# EAGLE design balance (EAGLE 6.6.0)
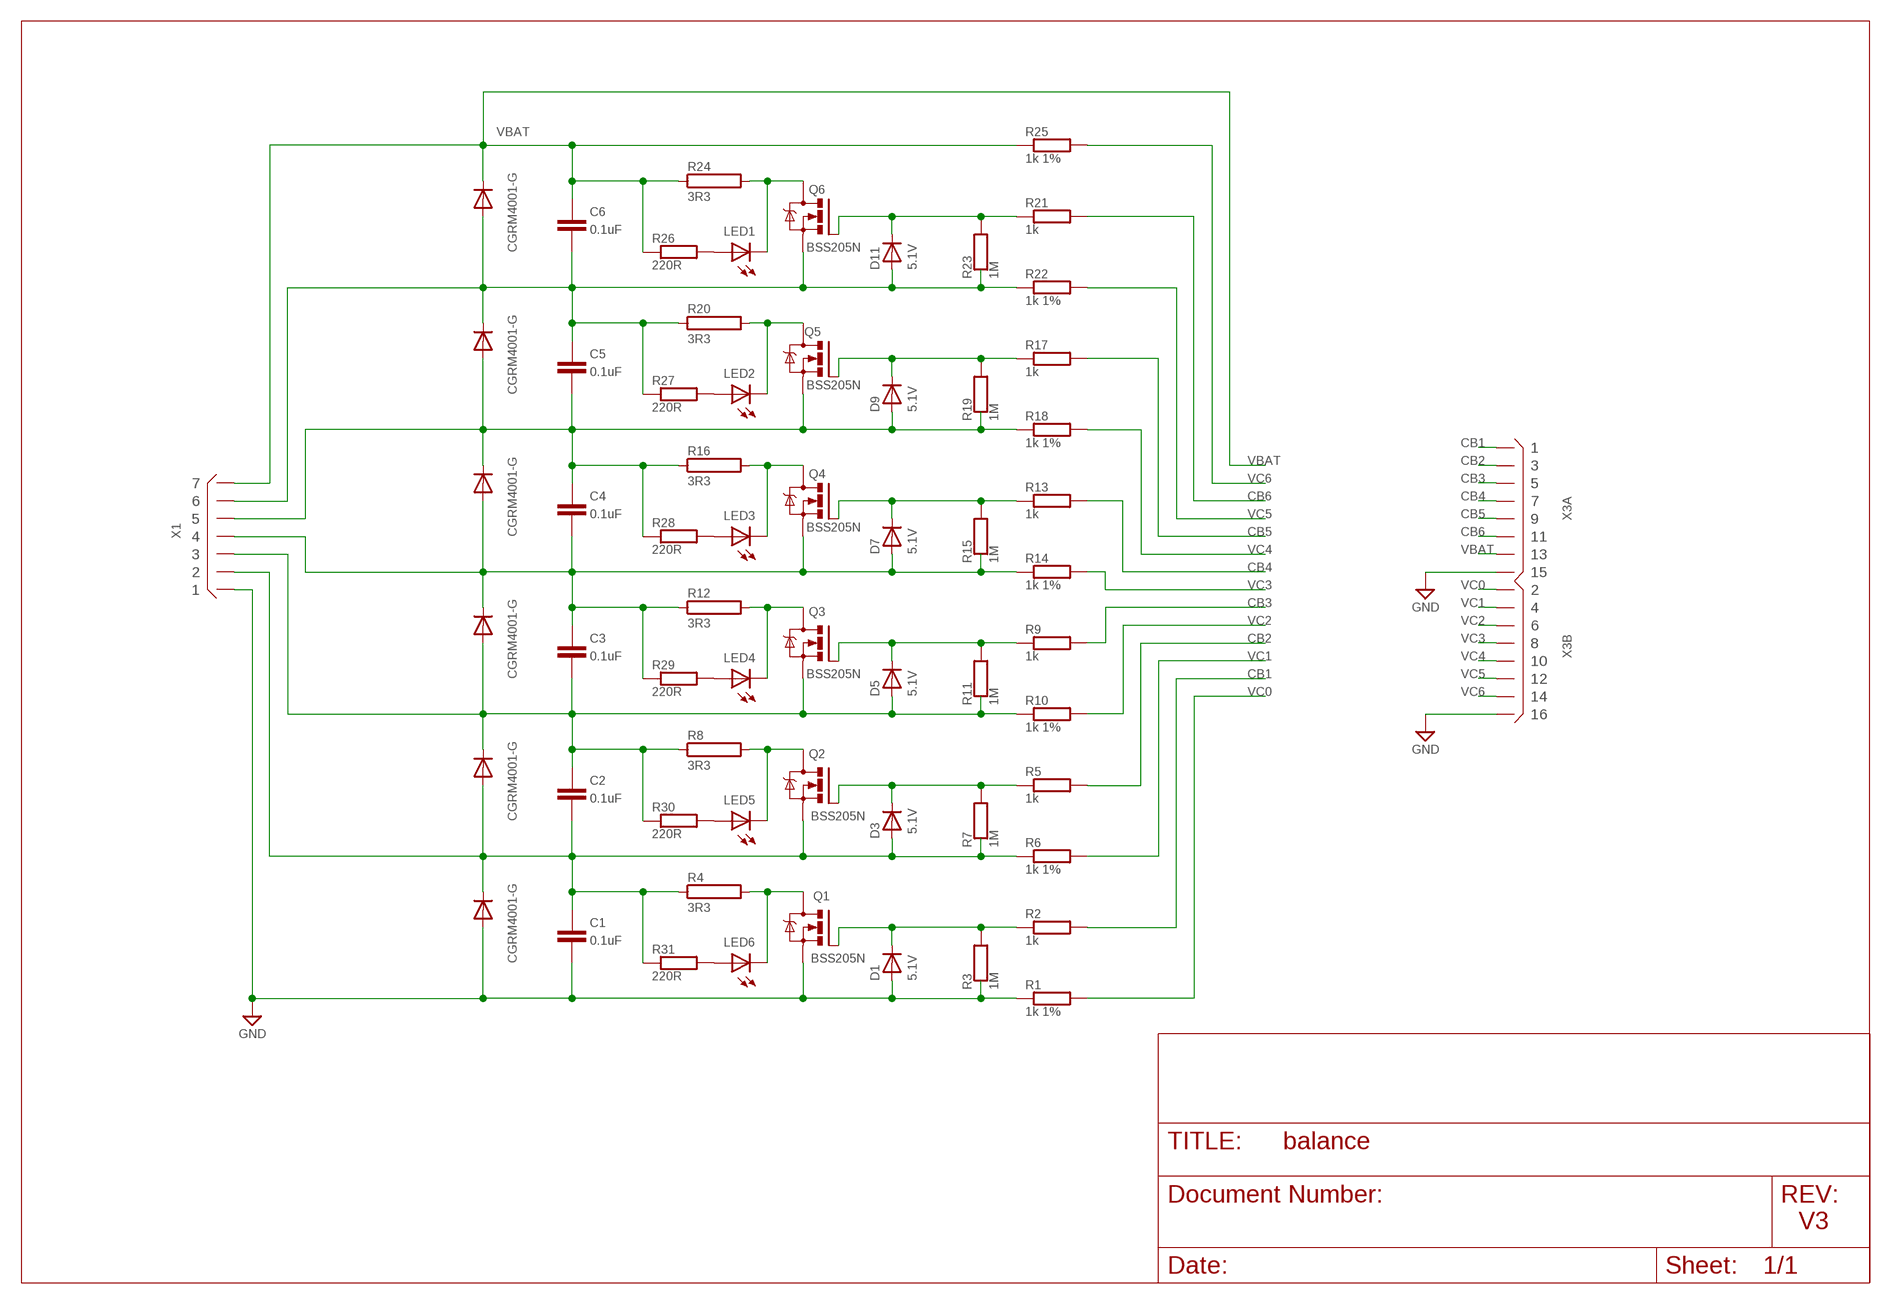
[diagram p0: schematic, sheet 1]

## Parts
C1  0.1uF  CSTD  [C0805]
C2  0.1uF  CSTD  [C0805]
C3  0.1uF  CSTD  [C0805]
C4  0.1uF  CSTD  [C0805]
C5  0.1uF  CSTD  [C0805]
C6  0.1uF  CSTD  [C0805]
D1  5.1V  DIODESOD  [SOD-323]
D2  CGRM4001-G  [SOD-123_MINI-SMA]
D3  5.1V  DIODESOD  [SOD-323]
D4  CGRM4001-G  [SOD-123_MINI-SMA]
D5  5.1V  DIODESOD  [SOD-323]
D6  CGRM4001-G  [SOD-123_MINI-SMA]
D7  5.1V  DIODESOD  [SOD-323]
D8  CGRM4001-G  [SOD-123_MINI-SMA]
D9  5.1V  DIODESOD  [SOD-323]
D10  CGRM4001-G  [SOD-123_MINI-SMA]
D11  5.1V  DIODESOD  [SOD-323]
D12  CGRM4001-G  [SOD-123_MINI-SMA]
LED1  LEDCHIP-LED0805  [CHIP-LED0805]
LED2  LEDCHIP-LED0805  [CHIP-LED0805]
LED3  LEDCHIP-LED0805  [CHIP-LED0805]
LED4  LEDCHIP-LED0805  [CHIP-LED0805]
LED5  LEDCHIP-LED0805  [CHIP-LED0805]
LED6  LEDCHIP-LED0805  [CHIP-LED0805]
Q1  BSS205N  [SOT23]
Q2  BSS205N  [SOT23]
Q3  BSS205N  [SOT23]
Q4  BSS205N  [SOT23]
Q5  BSS205N  [SOT23]
Q6  BSS205N  [SOT23]
R1  1k 1%  R  [R0805]
R2  1k  R  [R0805]
R3  1M  R  [R0805]
R4  3R3  R  [HS15]
R5  1k  R  [R0805]
R6  1k 1%  R  [R0805]
R7  1M  R  [R0805]
R8  3R3  R  [HS15]
R9  1k  R  [R0805]
R10  1k 1%  R  [R0805]
R11  1M  R  [R0805]
R12  3R3  R  [HS15]
R13  1k  R  [R0805]
R14  1k 1%  R  [R0805]
R15  1M  R  [R0805]
R16  3R3  R  [HS15]
R17  1k  R  [R0805]
R18  1k 1%  R  [R0805]
R19  1M  R  [R0805]
R20  3R3  R  [HS15]
R21  1k  R  [R0805]
R22  1k 1%  R  [R0805]
R23  1M  R  [R0805]
R24  3R3  R  [HS15]
R25  1k 1%  R  [R0805]
R26  220R  R  [R0805]
R27  220R  R  [R0805]
R28  220R  R  [R0805]
R29  220R  R  [R0805]
R30  220R  R  [R0805]
R31  220R  R  [R0805]
X1  B7B-XH  [B7B-XH]
X3  X08X2DR  [X16R-DIL]

## Nets
1: LED6.C Q1.3(D) R4.2
2: C1.2 C2.1 D2.C D3.2(A) D4.A Q2.2(S) R4.1 R6.1 R7.1 R31.1 X1.P$2
3: LED5.C Q2.3(D) R8.2
4: C2.2 C3.1 D4.C D5.2(A) D6.A Q3.2(S) R8.1 R10.1 R11.1 R30.1 X1.P$3
5: LED4.C Q3.3(D) R12.2
6: C3.2 C4.1 D6.C D7.2(A) D8.A Q4.2(S) R12.1 R14.1 R15.1 R29.1 X1.P$4
7: LED3.C Q4.3(D) R16.2
8: C4.2 C5.1 D8.C D9.2(A) D10.A Q5.2(S) R16.1 R18.1 R19.1 R28.1 X1.P$5
9: LED2.C Q5.3(D) R20.2
10: C5.2 C6.1 D10.C D11.2(A) D12.A Q6.2(S) R20.1 R22.1 R23.1 R27.1 X1.P$6
11: LED1.C Q6.3(D) R24.2
CB1: R2.2 X3.1
CB2: R5.2 X3.3
CB3: R9.2 X3.5
CB4: R13.2 X3.7
CB5: R17.2 X3.9
CB6: R21.2 X3.11
GND: C1.1 D1.2(A) D2.A Q1.2(S) R1.1 R3.1 X1.P$1 X3.15 X3.16
N$2: D1.1(C) Q1.1(G) R2.1 R3.2
N$4: D3.1(C) Q2.1(G) R5.1 R7.2
N$5: LED1.A R26.2
N$6: LED2.A R27.2
N$7: LED3.A R28.2
N$8: D5.1(C) Q3.1(G) R9.1 R11.2
N$9: LED4.A R29.2
N$10: LED5.A R30.2
N$11: LED6.A R31.2
N$12: D7.1(C) Q4.1(G) R13.1 R15.2
N$17: D9.1(C) Q5.1(G) R17.1 R19.2
N$21: D11.1(C) Q6.1(G) R21.1 R23.2
VBAT: C6.2 D12.C R24.1 R25.1 R26.1 X1.P$7 X3.13
VC0: R1.2 X3.2
VC1: R6.2 X3.4
VC2: R10.2 X3.6
VC3: R14.2 X3.8
VC4: R18.2 X3.10
VC5: R22.2 X3.12
VC6: R25.2 X3.14

## Notes on the sheet
- V3

## Library data of the parts
C1-C6 = useful:C
D1 D3 D5 D7 D9 D11 = SparkFun:DIODE: Diode These are standard reverse protection diodes and small signal diodes. SMA package can handle up to about 1A. SOD-323 can handle about 200mA. What the SOD-323 package when ordering, there are some mfgs out there that are 5-pin packages.
D2 D4 D6 D8 D10 D12 = diode:CGRM400*-G: Molded plasitc,JEDEC SOD-123/Mini SMA Source: Comchip CGRM4001-G.pdf
LED1-LED6 = led:LED: LED OSRAM: - CHIPLED LG R971, LG N971, LY N971, LG Q971, LY Q971, LO R971, LY R971 LH N974, LH R974 LS Q976, LO Q976, LY Q976 LO Q996 - Hyper CHIPLED LW Q18S LB Q993, LB Q99A, LB R99A - SideLED LS A670, LO A670, LY A670, LG A670, LP A670 LB A673, LV A673, LT A673, LW A673 LH A674 LY A675 LS A676, LA A676, LO A676, LY A676, LW A676 LS A679, LY A679, LG A679 - Hyper Micro SIDELED® LS Y876, LA Y876, LO Y876, LY Y876 LT Y87S - SmartLED LW L88C, LW L88S LB L89C, LB L89S, LG L890 LS L89K, LO L89K, LY L89K LS L896, LA L896, LO L896, LY L896 - TOPLED LS T670, LO T670, LY T670, LG T670, LP T670 LSG T670, LSP T670, LSY T670, LOP T670, LYG T670 LG T671, LOG T671, LSG T671 LB T673, LV T673, LT T673, LW T673 LH T674 LS T676, LA T676, LO T676, LY T676, LB T676, LH T676, LSB T676, LW T676 LB T67C, LV T67C, LT T67C, LS T67K, LO T67K, LY T67K, LW E67C LS E67B, LA E67B, LO E67B, LY E67B, LB E67C, LV E67C, LT E67C LW T67C LS T679, LY T679, LG T679 LS T770, LO T770, LY T770, LG T770, LP T770 LB T773, LV T773, LT T773, LW T773 LH T774 LS E675, LA E675, LY E675, LS T675 LS T776, LA T776, LO T776, LY T776, LB T776 LHGB T686 LT T68C, LB T68C - Hyper Mini TOPLED® LB M676 - Mini TOPLED Santana® LG M470 LS M47K, LO M47K, LY M47K Source: http://www.osram.convergy.de LUXEON: - LUMILED® LXK2-PW12-R00, LXK2-PW12-S00, LXK2-PW14-U00, LXK2-PW14-V00 LXK2-PM12-R00, LXK2-PM12-S00, LXK2-PM14-U00 LXK2-PE12-Q00, LXK2-PE12-R00, LXK2-PE12-S00, LXK2-PE14-T00, LXK2-PE14-U00 LXK2-PB12-K00, LXK2-PB12-L00, LXK2-PB12-M00, LXK2-PB14-N00, LXK2-PB14-P00, LXK2-PB14-Q00 LXK2-PR12-L00, LXK2-PR12-M00, LXK2-PR14-Q00, LXK2-PR14-R00 LXK2-PD12-Q00, LXK2-PD12-R00, LXK2-PD12-S00 LXK2-PH12-R00, LXK2-PH12-S00 LXK2-PL12-P00, LXK2-PL12-Q00, LXK2-PL12-R00 Source: www.luxeon.com KINGBRIGHT: KA-3528ASYC Source: www.kingbright.com
Q1-Q6 = infineon:BSS205N: Infineon Small Signal Transistor, OptiMOS 2 Technology, 20V, 2.5A SOT23
R1-R3 R5-R7 R9-R11 R13-R15 R17-R19 R21-R23 R25-R31 = useful:R
R4 R8 R12 R16 R20 R24 = special:R
X1 = con-jst-xh:?7B-XH
X3 = connectors:X08X2: Connector 2x8 pins

## Board
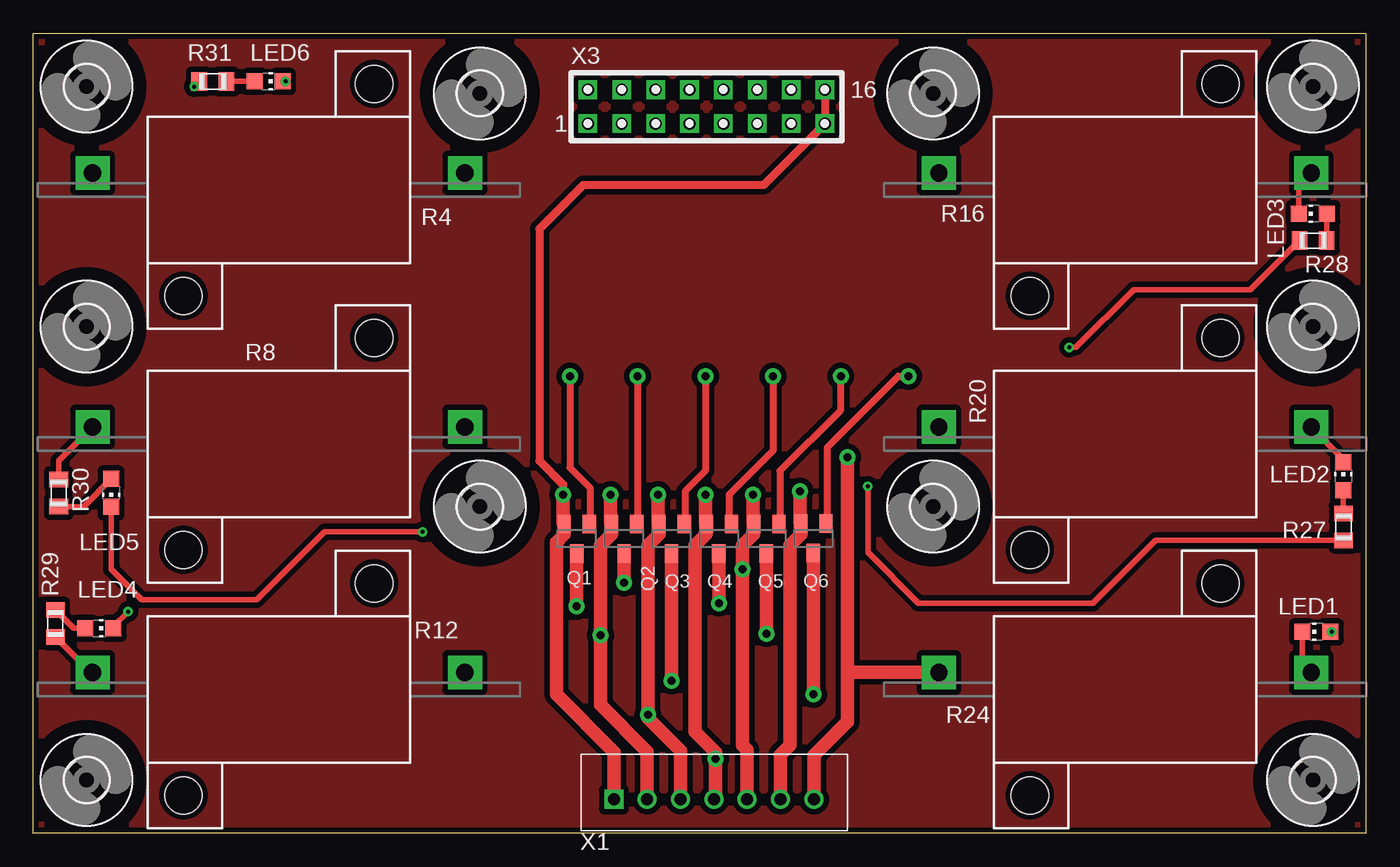
[diagram p1: board, top side]
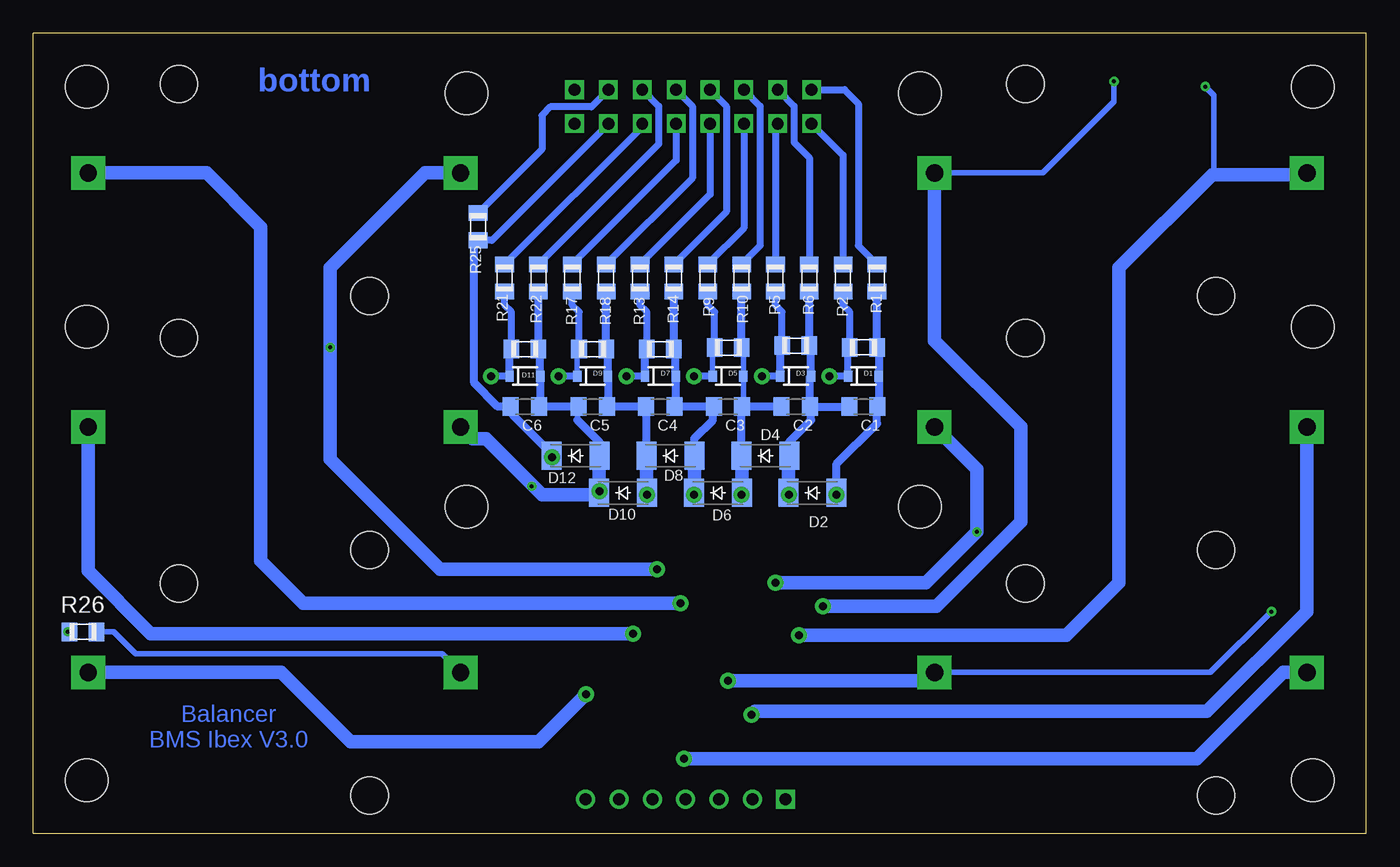
[diagram p2: board, bottom side, seen from below]

Size 100 x 60 mm. Coordinates in mm from the lower left corner, seen from the top.
Outline: 0,0 0,60 100,60 100,0 0,0
Copper layers (1+2*15+16): Top 0.035mm / dielectric 0.2mm / Route2 0.035mm / dielectric 0.5mm / Route15 0.035mm / dielectric 0.2mm / Bottom 0.035mm
Design rules "ats_35u_4layer_2 *": minimum track width 10mil, minimum drill 0.2mm, track to track 10mil, track to pad 10mil, pad to pad 10mil, via to via 10mil, smd to smd 10mil, copper to edge 0.3mm, drill to drill 8mil, minimum pad ring 10mil, minimum via ring 0.2mm, stop-mask expansion 4mil, vias tented up to drill 0mil, thermal gap 10mil

### Footprints (pad centres in the part's own frame; a part is rotated, then mirrored left to right if it is on the bottom)
C0805 = smd 1.2 x 1.4: 1 -1.066,0; 2 1.066,0
SOD-323 = smd 0.63 x 0.83: 1 -1.15,0; 2 1.15,0
SOD-123_MINI-SMA = smd 1.5 x 2.1: A 1.8,0; C -1.8,0
CHIP-LED0805 = smd 1.2 x 1.2: A 0,-1.05; C 0,1.05
SOT23 = smd 1 x 1.4: 1 -0.95,-1.1; 2 0.95,-1.1; 3 0,1.1
R0805 = smd 1.168 x 1.397: 1 -1.016,0; 2 1.016,0
HS15 = drill 1.3 pad 2.54 square: 1 -13.97,1.27; 2 13.97,1.27 | hole 2.8: -7.15,-7.95; 7.15,7.95
3,2 = hole 3.2: 0,0
B7B-XH = drill 0.9 pad 1.422 square: P$1 0,0 | drill 0.9 pad 1.422: P$2 2.5,0; P$3 5,0; P$4 7.5,0; P$5 10,0; P$6 12.5,0; P$7 15,0
X16R-DIL = drill 0.889 pad 1.397 square: 1 -8.89,-1.27; 2 -8.89,1.27; 3 -6.35,-1.27; 4 -6.35,1.27; 5 -3.81,-1.27; 6 -3.81,1.27; 7 -1.27,-1.27; 8 -1.27,1.27; 9 1.27,-1.27; 10 1.27,1.27; 11 3.81,-1.27; 12 3.81,1.27; 13 6.35,-1.27; 14 6.35,1.27; 15 8.89,-1.27; 16 8.89,1.27

### Placement (x,y rotation side)
C1  37.72,32 180 bottom
C2  42.8,32 180 bottom
C3  47.88,32 180 bottom
C4  52.96,32 180 bottom
C5  58.04,32 180 bottom
C6  63.12,32 180 bottom
D1  37.72,34.29 0 bottom
D2  41.53,25.53 0 bottom
D3  42.8,34.29 0 bottom
D4  45.09,28.32 0 bottom
D5  47.88,34.29 0 bottom
D6  48.64,25.53 0 bottom
D7  52.96,34.29 0 bottom
D8  52.2,28.32 0 bottom
D9  58.04,34.29 0 bottom
D10  55.75,25.53 0 bottom
D11  63.12,34.29 0 bottom
D12  59.31,28.32 0 bottom
LED1  96.27,15.11 90 top
LED2  98.3,26.8 0 top
LED3  96.01,46.48 90 top
LED4  4.95,15.37 270 top
LED5  5.84,25.53 180 top
LED6  17.65,56.39 270 top
Q1  40.77,22.1 180 top
Q2  44.32,22.1 180 top
Q3  47.88,22.1 180 top
Q4  51.44,22.1 180 top
Q5  54.99,22.1 180 top
Q6  58.52,22.13 180 top
R1  36.7,41.66 90 bottom
R2  39.24,41.66 90 bottom
R3  37.72,36.45 180 bottom
R4  18.41,48.26 0 top
R5  44.32,41.66 90 bottom
R6  41.78,41.66 90 bottom
R7  42.8,36.58 180 bottom
R8  18.41,29.21 0 top
R9  49.4,41.66 90 bottom
R10  46.86,41.66 90 bottom
R11  47.87,36.44 180 bottom
R12  18.41,10.79 0 top
R13  54.48,41.66 90 bottom
R14  51.94,41.66 90 bottom
R15  52.96,36.32 180 bottom
R16  81.92,48.26 0 top
R17  59.56,41.66 90 bottom
R18  57.02,41.66 90 bottom
R19  58.04,36.32 180 bottom
R20  81.92,29.21 0 top
R21  64.64,41.66 90 bottom
R22  62.1,41.66 90 bottom
R23  63.12,36.32 180 bottom
R24  81.92,10.79 0 top
R25  66.64,45.5 90 bottom
R26  96.27,15.11 180 bottom
R27  98.3,22.99 90 top
R28  96.01,44.45 0 top
R29  1.65,15.75 90 top
R30  1.91,25.53 270 top
R31  13.46,56.39 0 top
U$1  [3,2]  4,4 0 top
U$2  [3,2]  4,56 0 top
U$3  [3,2]  96,4 0 top
U$4  [3,2]  96,56 0 top
U$5  [3,2]  67.5,55.5 0 top
U$6  [3,2]  33.5,55.5 0 top
U$7  [3,2]  67.5,24.5 0 top
U$8  [3,2]  4,38 0 top
U$9  [3,2]  96,38 0 top
U$10  [3,2]  33.5,24.5 0 top
X1  43.56,2.54 0 top
X3  50.5,54.5 0 top

### Tracks (layer width: path | path; a pad name or v marks a point on that pad's centre or on a via)
1  (via drill 0.3, 0.6)
  Top 0.406: LED6.C v18.92,56.39
  Top 1.016: Q1.3 v40.77,17.02
  Bottom 0.406: R4.2 24.26,49.53 18.92,54.86 v18.92,56.39
  Bottom 1.016: v40.77,17.02 32.26,17.02 25.91,23.37 25.91,30.48 32.38,36.96 R4.2
2  (via drill 0.3, 0.6)
  Top 0.406: R31.1 v12.06,56.01
  Top 1.016: v43.31,25.4 43.31,23.26 Q2.2 43.37,22.42 42.55,21.59 v42.55,14.86 42.55,9.65 46.06,6.14 X1.P$2
  Bottom 0.406: 41.65,36.44 R7.1 | 43.24,25.44 D2.C | 43.33,28.28 D4.A | 41.66,31.93 C2.1 | 41.73,34.21 D3.2 | v12.06,56.01 11.43,55.37 11.43,49.4
  Bottom 0.508: 43.24,25.44 43.27,25.44 v43.31,25.4
  Bottom 0.61: R7.1 R6.1 | D3.2 41.65,36.44 | C1.2 C2.1 41.73,34.21 | D4.A 43.28,29.36 41.66,30.99 41.66,31.93
  Bottom 1.016: D2.C 43.33,28.28 | v42.55,14.86 22.48,14.86 18.54,18.8 18.54,42.42 11.56,49.4 11.43,49.4 4.57,49.4 R4.1
3  (via drill 0.3, 0.6)
  Top 0.406: LED5.C 5.84,19.81 8.13,17.53 16.76,17.53 21.84,22.61 v29.21,22.61
  Top 1.016: Q2.3 v44.32,18.8
  Bottom 1.016: v44.32,18.8 33.91,18.8 33.4,18.8 33.02,18.8 v29.21,22.61 29.21,27.3 R8.2
4  (via drill 0.6)
  Top 0.406: R30.1 1.91,27.94 R8.1
  Top 1.016: v46.86,25.4 46.86,23.26 Q3.2 46.93,22.42 46.1,21.59 v46.1,8.89 46.1,8.64 48.56,6.18 X1.P$3
  Bottom 0.406: R11.1 46.73,36.31 D5.2 46.73,32.09 C3.1 46.88,31.93 | 46.84,28.28 D4.C
  Bottom 0.508: D6.A 46.84,25.42 v46.86,25.4 | 46.86,40.89 46.86,40.88 R10.1
  Bottom 0.61: R11.1 46.86,40.89 | C2.2 C3.1 | D4.C 46.88,31.93
  Bottom 1.016: D6.A 46.84,28.28 | v46.1,8.89 45.85,9.14 11.94,9.14 4.45,16.64 R8.1
5  (via drill 0.3, 0.6)
  Top 0.406: LED4.C 6,15.53 v7.11,16.64
  Top 1.016: Q3.3 v47.88,11.43
  Bottom 0.406: R12.2 11.68,12.06 v7.11,16.64
  Bottom 1.016: v47.88,11.43 33.02,11.43 R12.2
6  (via drill 0.6)
  Top 0.406: R29.1 4.32,12.06 R12.1
  Top 1.016: v50.42,25.4 50.42,23.26 Q4.2 50.48,22.42 49.66,21.59 49.66,7.62 51.18,6.1 v51.18,5.59 51.18,2.66 X1.P$4
  Bottom 0.406: 51.81,36.19 R15.1 | 51.81,32.09 C4.1 | 50.4,25.57 D6.C | 49.02,31.93 C3.2
  Bottom 0.508: D6.C 50.44,25.42 v50.42,25.4
  Bottom 0.61: R15.1 R14.1 | 51.81,36.19 D7.2 51.81,32.09 | C3.2 C4.1 | D8.A 50.4,29.61 49.02,30.99 49.02,31.93
  Bottom 1.016: D8.A 50.4,25.57 | v51.18,5.59 12.7,5.59 6.22,12.06 R12.1
7  (via drill 0.6)
  Top 0.406: LED3.C 94.96,48.61 R16.2
  Top 1.016: Q4.3 v51.44,17.27
  Bottom 1.016: v51.44,17.27 79.76,17.27 82.93,20.45 82.93,45.47 87,49.53 R16.2
8  (via drill 0.3, 0.6)
  Top 0.406: R28.1 91.31,40.77 82.55,40.77 78.23,36.45 v77.72,36.45
  Top 1.016: v53.98,25.4 53.98,23.26 Q5.2 54.04,22.42 53.21,21.59 v53.21,19.81 53.21,6.6 53.56,6.26 X1.P$5
  Bottom 0.406: 56.89,36.19 R19.1 | 56.89,32.09 C5.1 | 54,31.98 C4.2
  Bottom 0.508: v53.98,25.4 53.95,25.42 D10.A 54,25.57 54,25.82
  Bottom 0.61: R19.1 R18.1 | 56.89,36.19 D9.2 56.89,32.09 | C4.2 C5.1 | D8.C 54,31.98
  Bottom 1.016: D8.C 54,25.82 | R16.1 70.61,49.53 77.72,42.42 v77.72,36.45 77.72,28.07 69.47,19.81 v53.21,19.81
9  (via drill 0.6)
  Top 0.406: LED2.C 98.3,28.07 R20.2
  Top 1.016: Q5.3 v54.99,14.99
  Bottom 1.016: v54.99,14.99 91.19,14.99 95.89,19.68 R20.2
10  (via drill 0.3, 0.6)
  Top 0.406: Q6.2 57.53,23.23 57.53,23.39 | R27.1 84.2,21.97 79.5,17.27 66.42,17.27 62.61,21.08 v62.61,26.04
  Top 1.016: v57.53,25.65 57.53,23.39 | X1.P$6 56.06,5.9 56.77,6.6 56.77,21.59 57.6,22.42 57.6,23.23 Q6.2
  Bottom 0.406: 61.97,36.19 R23.1 | 61.97,32.09 C6.1 | 57.55,28.28 D12.A | 57.47,25.44 D10.C | 59.18,30.99 59.18,31.93 C5.2 | v62.61,26.04 62.55,26.1
  Bottom 0.508: 57.47,25.44 57.47,25.59 v57.53,25.65
  Bottom 0.61: R23.1 R22.1 | 61.97,36.19 D11.2 61.97,32.09 | C5.2 C6.1 | D12.A 57.51,29.32 59.18,30.99
  Bottom 1.016: 57.55,28.28 D10.C 57.68,25.4 61.85,25.4 62.55,26.1 66.04,29.59 67.06,29.59 R20.1
11  (via drill 0.6)
  Top 0.406: LED1.C 95.22,12.73 R24.2
  Top 1.016: Q6.3 58.52,10.44 v58.55,10.41
  Bottom 1.016: v58.55,10.41 62.1,6.86 76.2,6.86 81.41,12.06 R24.2
CB1
  Bottom 0.508: X3.1 39.24,50.86 R2.2
CB2
  Bottom 0.508: X3.3 44.32,53.06 R5.2
CB3
  Bottom 0.508: X3.5 46.69,45.38 R9.2
CB4
  Bottom 0.508: X3.7 49.23,47.92 R13.2
CB5
  Bottom 0.508: X3.9 51.77,50.47 R17.2
CB6
  Bottom 0.508: 54.31,53.01 R21.2
  Bottom 0.61: X3.11 54.31,53.01
GND  (via drill 0.6)
  Top 0.61: X3.16 X3.15 54.8,48.64 41.27,48.64 37.97,45.34 37.97,27.94 39.75,26.16 39.75,24.89
  Top 1.016: v39.75,25.4 39.75,24.89 39.75,23.26 Q1.2 39.82,22.42 39.24,21.84 39.24,10.41 43.56,6.1 X1.P$1
  Bottom 0.406: 36.57,32.09 C1.1 36.7,31.95 | 39.69,25.48 D2.A
  Bottom 0.508: 39.69,25.48 39.69,25.47 v39.75,25.4 | 36.57,36.44 36.58,36.45 R3.1
  Bottom 0.61: R3.1 R1.1 | 36.57,36.44 D1.2 36.57,32.09 | D2.A 39.73,27.71 36.7,30.73 36.7,31.95
N$1
  pour Top (isolate 0.406): 0,60 100,60 100,0 0,0
N$2  (via drill 0.6)
  Top 0.406: Q1.1 41.78,23.26
  Top 0.508: v40.26,34.29 40.26,27.43 41.78,25.91 41.78,23.26
  Bottom 0.508: R2.1 39.24,39.62 38.73,39.12 R3.2 38.87,36.31 D1.1 v40.26,34.29
N$4  (via drill 0.6)
  Top 0.406: Q2.1 45.27,23.43 45.34,23.5
  Top 0.508: v45.34,34.29 45.34,23.5 45.34,23.26
  Bottom 0.406: 43.95,36.44 R7.2
  Bottom 0.508: R7.2 43.81,39.12 44.32,39.62 R5.1 | D3.1 v45.34,34.29
  Bottom 0.61: D3.1 43.95,36.44
N$5  (via drill 0.3)
  Top 0.406: LED1.A v97.41,15.11
  Bottom 0.406: v97.41,15.11 R26.2
N$6
  Top 0.406: LED2.A R27.2
N$7
  Top 0.406: LED3.A 97.06,44.48 R28.2
N$8  (via drill 0.6)
  Top 0.406: Q3.1 48.83,23.3 48.9,23.37
  Top 0.508: v50.42,34.29 50.42,27.18 48.9,25.65 48.9,23.37 48.9,23.26
  Bottom 0.406: D5.1 49.03,36.3 R11.2
  Bottom 0.508: R11.2 48.89,39.11 49.4,39.62 R9.1 | D5.1 v50.42,34.29
N$9
  Top 0.406: R29.2 3.05,15.37 LED4.A
N$10
  Top 0.406: R30.2 3.78,24.51 LED5.A
N$11
  Top 0.406: R31.2 LED6.A
N$12  (via drill 0.6)
  Top 0.406: Q4.1 52.2,23.39
  Top 0.508: v55.5,34.29 55.5,28.7 52.2,25.4 52.2,23.39
  Bottom 0.406: 54.11,36.19 R15.2
  Bottom 0.508: R15.2 53.98,39.12 54.48,39.62 R13.1 | D7.1 v55.5,34.29
  Bottom 0.61: D7.1 54.11,36.19
N$17  (via drill 0.6)
  Top 0.406: 56.01,23.26 Q5.1
  Top 0.508: 56.01,23.26 56.01,27.18 60.58,31.75 v60.58,34.29
  Bottom 0.406: D9.1 59.19,36.19 R19.2
  Bottom 0.508: R19.2 59.05,39.12 59.56,39.62 R17.1 | D9.1 v60.58,34.29
N$21  (via drill 0.6)
  Top 0.406: Q6.1 59.53,23.23 59.56,23.26
  Top 0.508: 59.56,23.26 59.56,28.96 64.9,34.29 v65.66,34.29
  Bottom 0.406: 64.27,36.19 R23.2
  Bottom 0.508: R23.2 64.14,39.12 64.64,39.62 R21.1 | D11.1 v65.66,34.29
  Bottom 0.61: D11.1 64.27,36.19
VBAT  (via drill 0.6)
  Top 1.016: v61.09,28.19 61.09,12.06 | 61.09,12.06 61.09,8.38 58.56,5.86 X1.P$7 | R24.1 61.09,12.06
  Bottom 0.406: 64.14,31.95 C6.2 | R26.1 93.98,15.11 92.33,13.46 69.34,13.46 R24.1
  Bottom 0.508: X3.13 65.6,44.48 R25.1
  Bottom 0.61: R25.1 66.93,44.19 66.93,33.78 65.15,32 C6.2 64.01,31.83 64.01,31.37 61.11,28.47 D12.C
  Bottom 1.016: D12.C 61.09,28.3 v61.09,28.19
VC0
  Bottom 0.508: X3.2 39.13,55.77 38.1,54.74 38.1,44.07 R1.2
VC1
  Bottom 0.508: X3.4 42.93,54.55 42.93,51.82 41.78,50.67 R6.2
  Bottom 0.61: 41.76,42.69 R6.2
VC2
  Bottom 0.508: X3.6 45.47,54.55 45.47,44.07 R10.2
VC3
  Bottom 0.508: X3.8 48.01,54.55 48.01,46.61 R14.2
VC4
  Bottom 0.508: X3.10 50.55,54.55 50.55,49.15 R18.2
VC5
  Bottom 0.508: X3.12 53.09,54.55 53.09,51.69 R22.2
VC6
  Bottom 0.508: X3.14 58.14,54.48 61.21,54.48 61.85,53.85 61.85,51.3 R25.2

### Text on the board
Bottom: bottom | Balancer / BMS Ibex V3.0
tTest: Balancer / BMS Ibex V3.0 | TERA TU Graz, / Pöschl & Moni | BSS205N | Balancer V3.0 | 1
bTest: 0.1uF | 5.1V, / 500mW